# Altium schematic sheet Sheet1.SchDoc
size A4; SheetNumber: 1; SheetTotal: 1
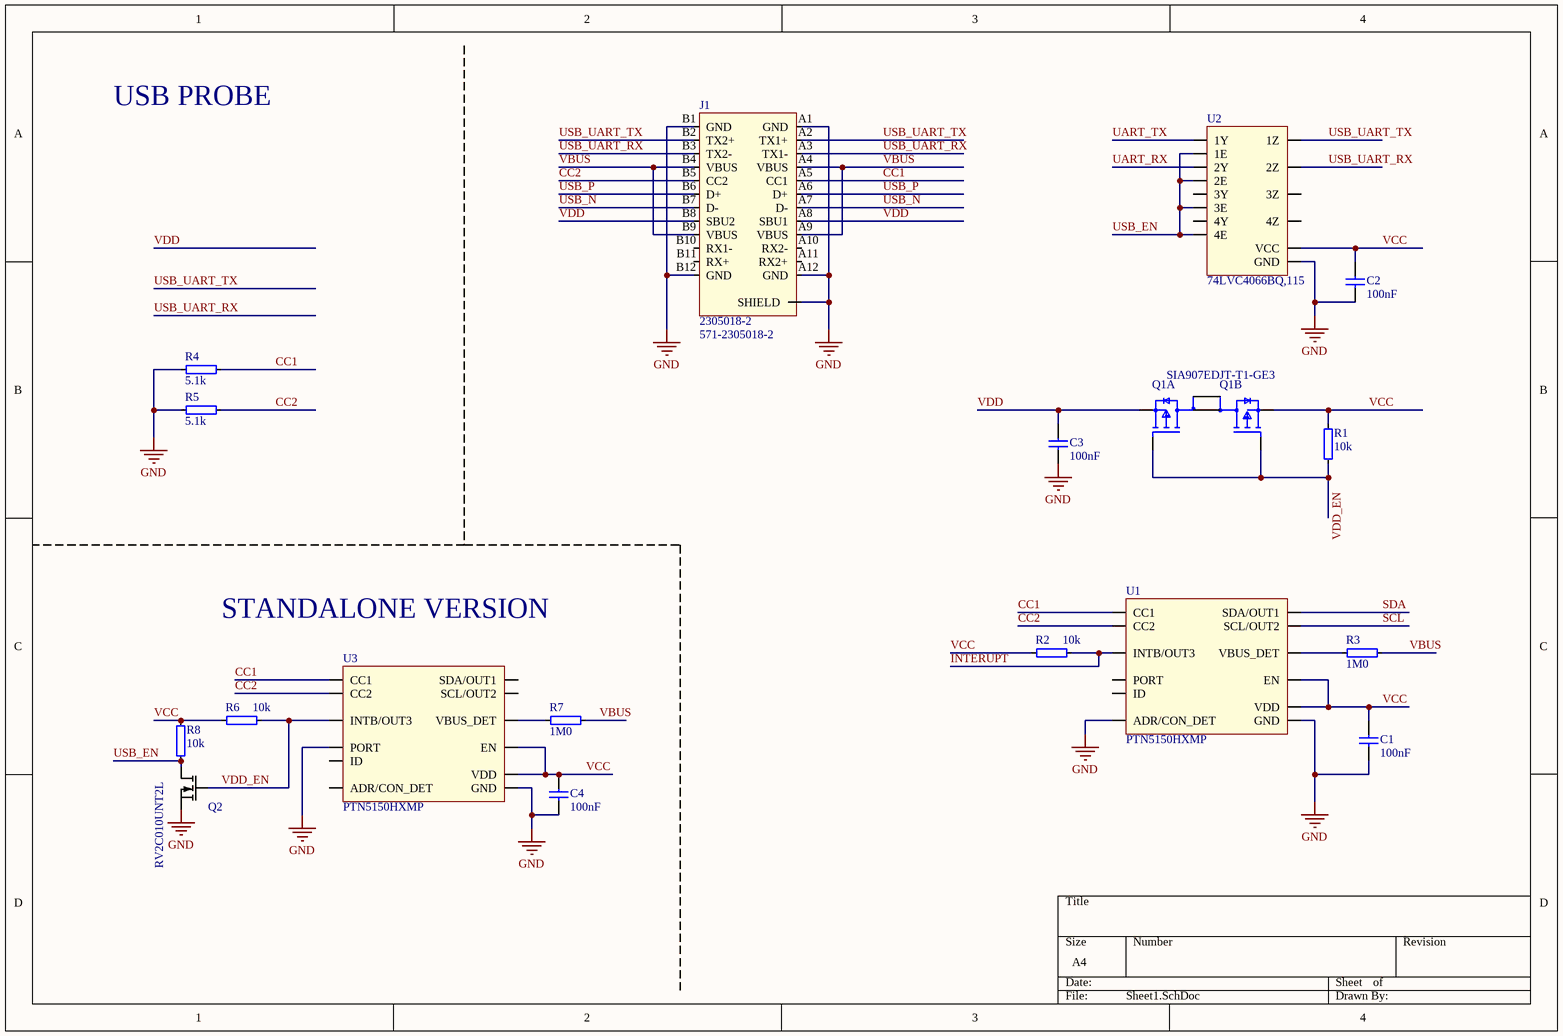
[diagram p0: Sheet1.SchDoc]

## Parts
C1  100nF  [CAPC0603X03L_C]
C2  100nF  [CAPC0603X03L_C]
C3  100nF  [CAPC0603X03L_C]
C4  100nF  [CAPC0603X03L_C]
J1  2305018-2  Supplier Part Number 1: 571-2305018-2  [2305018-2]
Q1  SIA907EDJT-T1-GE3  [FP-C-07431-DUAL-MFG]  (parts A,B of 2)
Q2  RV2C010UNT2L  [DFN65P100X40-3L]
R1  10k  [RESC0603X03L_C]
R2  10k  [RESC0603X03L_C]
R3  1M0  [RESC0603X03L_C]
R4  5.1k  [RESC0603X03L_C]
R5  5.1k  [RESC0603X03L_C]
R6  10k  [RESC0603X03L_C]
R7  1M0  [RESC0603X03L_C]
R8  10k  [RESC0603X03L_C]
U1  PTN5150HXMP  [PTN5150HXMP]
U2  74LVC4066BQ,115  [74LVC4066BQ,115]
U3  PTN5150HXMP  [PTN5150HXMP]

## Nets
GND: C1.1 C2.1 C3.1 C4.1 J1.A1(GND) J1.A12(GND) J1.B1(GND) J1.B12(GND) J1.SH1(SHIELD) Q2.2(S) R4.1 R5.1 U1.P5(ADR/CON_DET) U1.P10(GND) U2.P7(GND) U3.P3(PORT) U3.P10(GND)
CC1: J1.A5(CC1) R4.2 U1.P1(CC1) U3.P1(CC1)
CC2: J1.B5(CC2) R5.2 U1.P2(CC2) U3.P2(CC2)
INTERUPT: R2.2 U1.P6(INTB/OUT3)
SCL: U1.P8(SCL/OUT2)
SDA: U1.P7(SDA/OUT1)
UART_RX: U2.P4(2Y)
UART_TX: U2.P1(1Y)
USB_EN: Q2.3(D) R8.1 U2.P5(2E) U2.P6(3E) U2.P12(4E) U2.P13(1E)
USB_N: J1.A7(D-) J1.B7(D-)
USB_P: J1.A6(D+) J1.B6(D+)
USB_UART_RX: J1.A3(TX1-) J1.B3(TX2-) U2.P3(2Z)
USB_UART_TX: J1.A2(TX1+) J1.B2(TX2+) U2.P2(1Z)
VBUS: J1.A4(VBUS) J1.A9(VBUS) J1.B4(VBUS) J1.B9(VBUS) R3.2 R7.2
VCC: C1.2 C2.2 C4.2 Q1.4(S2) R1.2 R2.1 R6.1 R8.2 U1.P11(EN) U1.P12(VDD) U2.P14(VCC) U3.P11(EN) U3.P12(VDD)
VDD: C3.2 J1.A8(SBU1) J1.B8(SBU2) Q1.1(S1)
VDD_EN: Q1.2(G1) Q1.5(G2) Q2.1(G) R1.1 R6.2 U3.P6(INTB/OUT3)
NetQ1_3: Q1.3(D2) Q1.6(D1)
NetQ1_7: Q1.7(D1) Q1.8(D2)
NetR3_1: R3.1 U1.P4(VBUS_DET)
NetR7_1: R7.1 U3.P4(VBUS_DET)

Not connected (* = marked no-connect by the designer): J1 A10(RX2-) A11(RX2+) B10(RX1-) B11(RX+); U1 P3(PORT) P9(ID); U2 P8(3Y) P9(3Z) P10(4Z) P11(4Y); U3 P5(ADR/CON_DET) P7(SDA/OUT1) P8(SCL/OUT2) P9(ID)

## Notes on the sheet
- USB PROBE
- STANDALONE VERSION

## Library data of the parts
C1-C4 = C0201-100n: Capacitor, X5R, ±10%; Manufacturer: N.A.; Part number IPS: 00000001248, 00000002505; Note: 16V; Pad Count: 2; Part Number: C0201-100n; Manufacturer Part Number: N.A.; ComponentLink1URL: N.A.; ComponentLink1Description: Datasheet; ComponentLink2URL: N.A.; ComponentLink2Description: Supplier link; HelpURL: N.A.; Footprint Doc: 0201; LatestRevisionDate: 2017-11-09; Published: 2014-11-13; Value: 100nF; Artikkelnr Noca: N.A.; Supplier 1: N.A.; Supplier Part Number 1: N.A.; Supplier 2: N.A.; Supplier Part Number 2: N.A.; Component Class: Capacitors; PartId: 100200078
J1 = 2305018-2: Usb 3.1 Type C, 10GBPS, Receptacle, Rigusb Connectors Usb Type C, Rec IPX8 on Board Dual SMT; pin to pad: SH1>SH1+SH2+SH3+SH4+SH5+SH6; Manufacturer: TE Connectivity AMP; Number of Contacts: 24; Number of Ports: 1; Current Rating: 1.25A; Voltage Rating: 30V; Shielding: Shielded; Ratings: Waterproof; Supplier 1: Mouser; Manufacturer Part Number: 2305018-2; RoHS: Yes; Category: USB Connectors; Stock 1: 85836; Pricing 1: 1=3.00000, 10=2.52000, 50=2.52000, 100=2.40000, 250=2.18000, 800=1.85000, 1000=1.85000, 2400=1.77000, 4800=1.71000, 10000=1.77000 (USD); Mount: Surface Mount,Through Hole; Contact Plating: Gold; Insulation Color: Black; Min Operating Temperature: -40°C; Max Operating Temperature: 85°C; Connector Type: USB; Packaging: Tape and Reel; Gender: Receptacle; Termination: Solder; Flammability Rating: UL94 V-0; RoHS Compliant: Yes; ComponentLink1URL: http://www.farnell.com/datasheets/2611889.pdf?src-supplier=Farnell; ComponentLink1Description: http://www.farnell.com/datasheets/2611889.pdf?src-supplier=Farnell; ComponentLink2URL: https://www.te.com/commerce/DocumentDelivery/DDEController?Action=srchrtrv&DocNm=2305018&DocType=Customer+Drawing&DocLang=English&src-supplier=Digi-Key; ComponentLink2Description: https://www.te.com/commerce/DocumentDelivery/DDEController?Action=srchrtrv&DocNm=2305018&DocType=Customer+Drawing&DocLang=English&src-supplier=Digi-Key; ComponentLink3URL: http://www.farnell.com/datasheets/2611889.pdf?src-supplier=Newark; ComponentLink3Description: http://www.farnell.com/datasheets/2611889.pdf?src-supplier=Newark
Q1 = SIA907EDJT-T1-GE3: SiA907EDJT Series Dual P Channel 20 V 0.057 Ohm 7.8 W Mosfet - PowerPAK SC-70-6L; Manufacturer: Vishay Siliconix; Rds On Max: 57mR; Rise Time: 10ns; Drain to Source Voltage (Vdss): 20V; Continuous Drain Current (ID): 4.5A; Max Power Dissipation: 7.8W; Gate to Source Voltage (Vgs): 12V; Turn-Off Delay Time: 30ns; Number of Elements: 2; Power Dissipation: 1.9W; Turn-On Delay Time: 5ns; Drain to Source Breakdown Voltage: -20V; Polarity: P-CHANNEL; Supplier 1: Mouser; Manufacturer Part Number: SIA907EDJT-T1-GE3; RoHS: Yes; Category: MOSFETs; Stock 1: 2602; Pricing 1: 1=0.57000, 10=0.49500, 50=0.49500, 100=0.37000, 500=0.29100, 1000=0.22500, 3000=0.20400, 6000=0.19100, 9000=0.18500, 10000=0.18500 (USD); Mount: Surface Mount; Number of Pins: 6; Weight: 0.000988oz; Min Operating Temperature: -55°C; Max Operating Temperature: 150°C; Packaging: Tape and Reel; Package Quantity: 3000; Drain to Source Resistance: 57mR; Fall Time: 10ns; Number of Channels: 2; On-State Resistance: 57mR; Element Configuration: Dual; Series: TrenchFET®; Drain-source On Resistance-Max: 57mR; Radiation Hardening: No; Lead Free: Contains Lead; RoHS Compliant: Yes; ComponentLink1URL: https://datasheet.ciiva.com/4444/sia907edjt-223688-4444605.pdf?src-supplier=Mouser; ComponentLink1Description: https://datasheet.ciiva.com/4444/sia907edjt-223688-4444605.pdf?src-supplier=Mouser; ComponentLink2URL: https://datasheet.ciiva.com/30021/sia907edjt-30021591.pdf?src-supplier=Avnet; ComponentLink2Description: https://datasheet.ciiva.com/30021/sia907edjt-30021591.pdf?src-supplier=Avnet; Supplier Part Number 1: 78-SIA907EDJT-T1-GE3
Q2 = RV2C010UNT2L: MOSFET Transistor, N Channel, 1 A, 20 V, 0.34 ohm, 4.5 V, 1 V RoHS Compliant: Yes; Manufacturer: Rohm; Drain to Source Voltage (Vdss): 20V; Continuous Drain Current (ID): 1A; Rds On Max: 470mR; Input Capacitance: 40pF; Max Power Dissipation: 400mW; Threshold Voltage: 1V; Resistance: 0.34R; Supplier 1: Mouser; Manufacturer Part Number: RV2C010UNT2L; RoHS: Yes; Category: MOSFETs; Stock 1: 3031; Pricing 1: 1=0.39000, 10=0.25100, 50=0.25100, 100=0.16500, 500=0.10900, 1000=0.08400, 2500=0.07700, 10000=0.07700 (USD); Mount: Surface Mount; Number of Pins: 1006; Max Operating Temperature: 150°C; Packaging: Cut Tape; REACH SVHC: No SVHC; RoHS Compliant: Yes; ComponentLink1URL: http://www.farnell.com/datasheets/1945594.pdf?src-supplier=Farnell; ComponentLink1Description: http://www.farnell.com/datasheets/1945594.pdf?src-supplier=Farnell; ComponentLink2URL: http://www.mouser.com/ds/2/348/rv2c010un-e-1139137.pdf?src-supplier=Mouser; ComponentLink2Description: http://www.mouser.com/ds/2/348/rv2c010un-e-1139137.pdf?src-supplier=Mouser; ComponentLink3URL: http://rohmfs.rohm.com/en/techdata_basic/transistor/taping/VML1006_T2L_taping.pdf?src-supplier=Digi-Key; ComponentLink3Description: http://rohmfs.rohm.com/en/techdata_basic/transistor/taping/VML1006_T2L_taping.pdf?src-supplier=Digi-Key; ComponentLink4URL: http://www.rohm.com/web/global/datasheet/RV2C010UN/rv2c010un-e?src-supplier=Digi-Key; ComponentLink4Description: http://www.rohm.com/web/global/datasheet/RV2C010UN/rv2c010un-e?src-supplier=Digi-Key; ComponentLink5URL: http://rohmfs.rohm.com/en/products/databook/datasheet/discrete/transistor/mosfet/rv2c010unt2l.pdf?src-supplier=Avnet; ComponentLink5Description: http://rohmfs.rohm.com/en/products/databook/datasheet/discrete/transistor/mosfet/rv2c010unt2l.pdf?src-supplier=Avnet; ComponentLink6URL: http://www.farnell.com/datasheets/1945594.pdf?src-supplier=Element14; ComponentLink6Description: http://www.farnell.com/datasheets/1945594.pdf?src-supplier=Element14; Supplier Part Number 1: 755-RV2C010UNT2L
R1 R2 R6 R8 = R0201-10k: Resistor, ±1%, 0.05W; Manufacturer: N.A.; Part number IPS: 00000001255; Note: Chip Res 1%; Pad Count: 2; Part Number: R0201-10k; Manufacturer Part Number: N.A.; ComponentLink1URL: N.A.; ComponentLink1Description: Datasheet; ComponentLink2URL: N.A.; ComponentLink2Description: Supplier link; HelpURL: N.A.; Footprint Doc: 0201; LatestRevisionDate: 2014-11-13; Published: 2014-11-13; Value: 10k; Artikkelnr Noca: N.A.; Supplier 1: N.A.; Supplier Part Number 1: N.A.; Supplier 2: N.A.; Supplier Part Number 2: N.A.; Component Class: Resistors; PartId: 100100065
R3 R7 = R0201-1M0: Resistor, ±1%, 0.05W; Manufacturer: N.A.; Part number IPS: 00000001418; Note: Chip Res 1%; Pad Count: 2; Part Number: R0201-1M0; Manufacturer Part Number: N.A.; Footprint Doc: 0201; LatestRevisionDate: 2014-11-13; Published: 2014-11-13; Value: 1M0; Artikkelnr Noca: N.A.; ComponentLink1URL: N.A.; ComponentLink1Description: Datasheet; ComponentLink2URL: N.A.; ComponentLink2Description: Supplier link; HelpURL: N.A.; Supplier 1: N.A.; Supplier Part Number 1: N.A.; Supplier 2: N.A.; Supplier Part Number 2: N.A.; Component Class: Resistors; PartId: 100100093
R4 R5 = R0201-4k7: Resistor, ±1%, 0.05W; Manufacturer: N.A.; Part number IPS: 00000001706; Value: 4k7; Note: Chip Res 1%; Pad Count: 2; Part Number: R0201-4k7; Manufacturer Part Number: N.A.; Footprint Doc: 0201; LatestRevisionDate: 2014-11-13; Published: 2014-11-13; Artikkelnr Noca: N.A.; ComponentLink1URL: N.A.; ComponentLink1Description: Datasheet; ComponentLink2URL: N.A.; ComponentLink2Description: Supplier link; HelpURL: N.A.; Supplier 1: N.A.; Supplier Part Number 1: N.A.; Supplier 2: N.A.; Supplier Part Number 2: N.A.; Component Class: Resistors; PartId: 100100061
U1 U3 = PTN5150HXMP: Usb Interface IC PTN5150HX/X2QFN12/REEL 13" Q2/; Manufacturer: NXP Semiconductors; Supplier 1: Mouser; Manufacturer Part Number: PTN5150HXMP; RoHS: Yes; Category: Integrated Circuits (ICs); Stock 1: 6997; Pricing 1: 1=1.34000, 10=1.21000, 25=1.15000, 50=1.15000, 100=0.93900, 250=0.87800, 500=0.77600, 1000=0.77000, 10000=0.77000 (USD); Number of Pins: 12; Min Operating Temperature: -40°C; Max Operating Temperature: 85°C; Packaging: Tape and Reel; Interface: USB; ComponentLink1URL: https://www.nxp.com/docs/en/data-sheet/PTN5150.pdf?src-supplier=Digi-Key; ComponentLink1Description: https://www.nxp.com/docs/en/data-sheet/PTN5150.pdf?src-supplier=Digi-Key; ComponentLink2URL: http://www.farnell.com/datasheets/2615733.pdf?src-supplier=Newark; ComponentLink2Description: http://www.farnell.com/datasheets/2615733.pdf?src-supplier=Newark; Supplier Part Number 1: 771-PTN5150HXMP
U2 = 74LVC4066BQ,115: 74LVC Series 5.5 V Quad Bilateral Switch - DHVQFN-14; pin to pad: P7>P7+P15; Manufacturer: Nexperia; Supplier 1: Mouser; Manufacturer Part Number: 74LVC4066BQ,115; RoHS: Yes; Category: Decoders and Multiplexers; Stock 1: 3323; Pricing 1: 1=0.67000, 10=0.56700, 50=0.56700, 100=0.44600, 1000=0.29700, 10000=0.28800 (USD); ComponentLink1URL: https://assets.nexperia.com/documents/data-sheet/74LVC4066.pdf?src-supplier=Digi-Key; ComponentLink1Description: https://assets.nexperia.com/documents/data-sheet/74LVC4066.pdf?src-supplier=Digi-Key; Supplier Part Number 1: 771-LVC4066BQ115